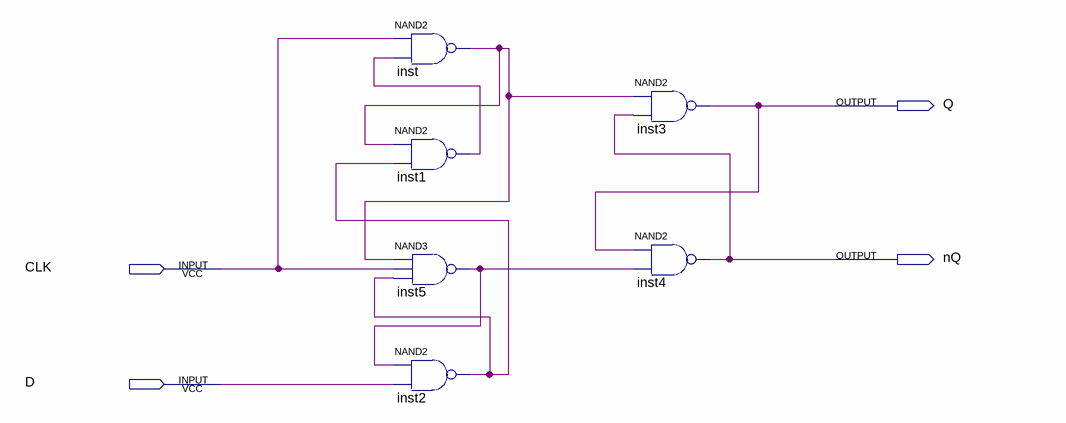
[diagram p0: schematic sheet]
// Quartus schematic DynD.bdf as structural Verilog: 6 symbols, 4 pins
module DynD (
  input  CLK,
  input  D,
  output Q,
  output nQ
);

  wire inst1_out, inst2_out, inst5_out, inst_out;

  nand inst (inst_out, CLK, inst1_out);
  nand inst1 (inst1_out, inst_out, inst2_out);
  nand inst5 (inst5_out, inst_out, CLK, inst2_out);
  nand inst2 (inst2_out, inst5_out, D);
  nand inst3 (Q, inst_out, nQ);
  nand inst4 (nQ, Q, inst5_out);
endmodule
